# Altium schematic sheet Analog_IN_block.SchDoc
size 420 x 297 mm; DocumentNumber: ЛАЭ3.20.10.02.05.200 Э3; SheetNumber: 7
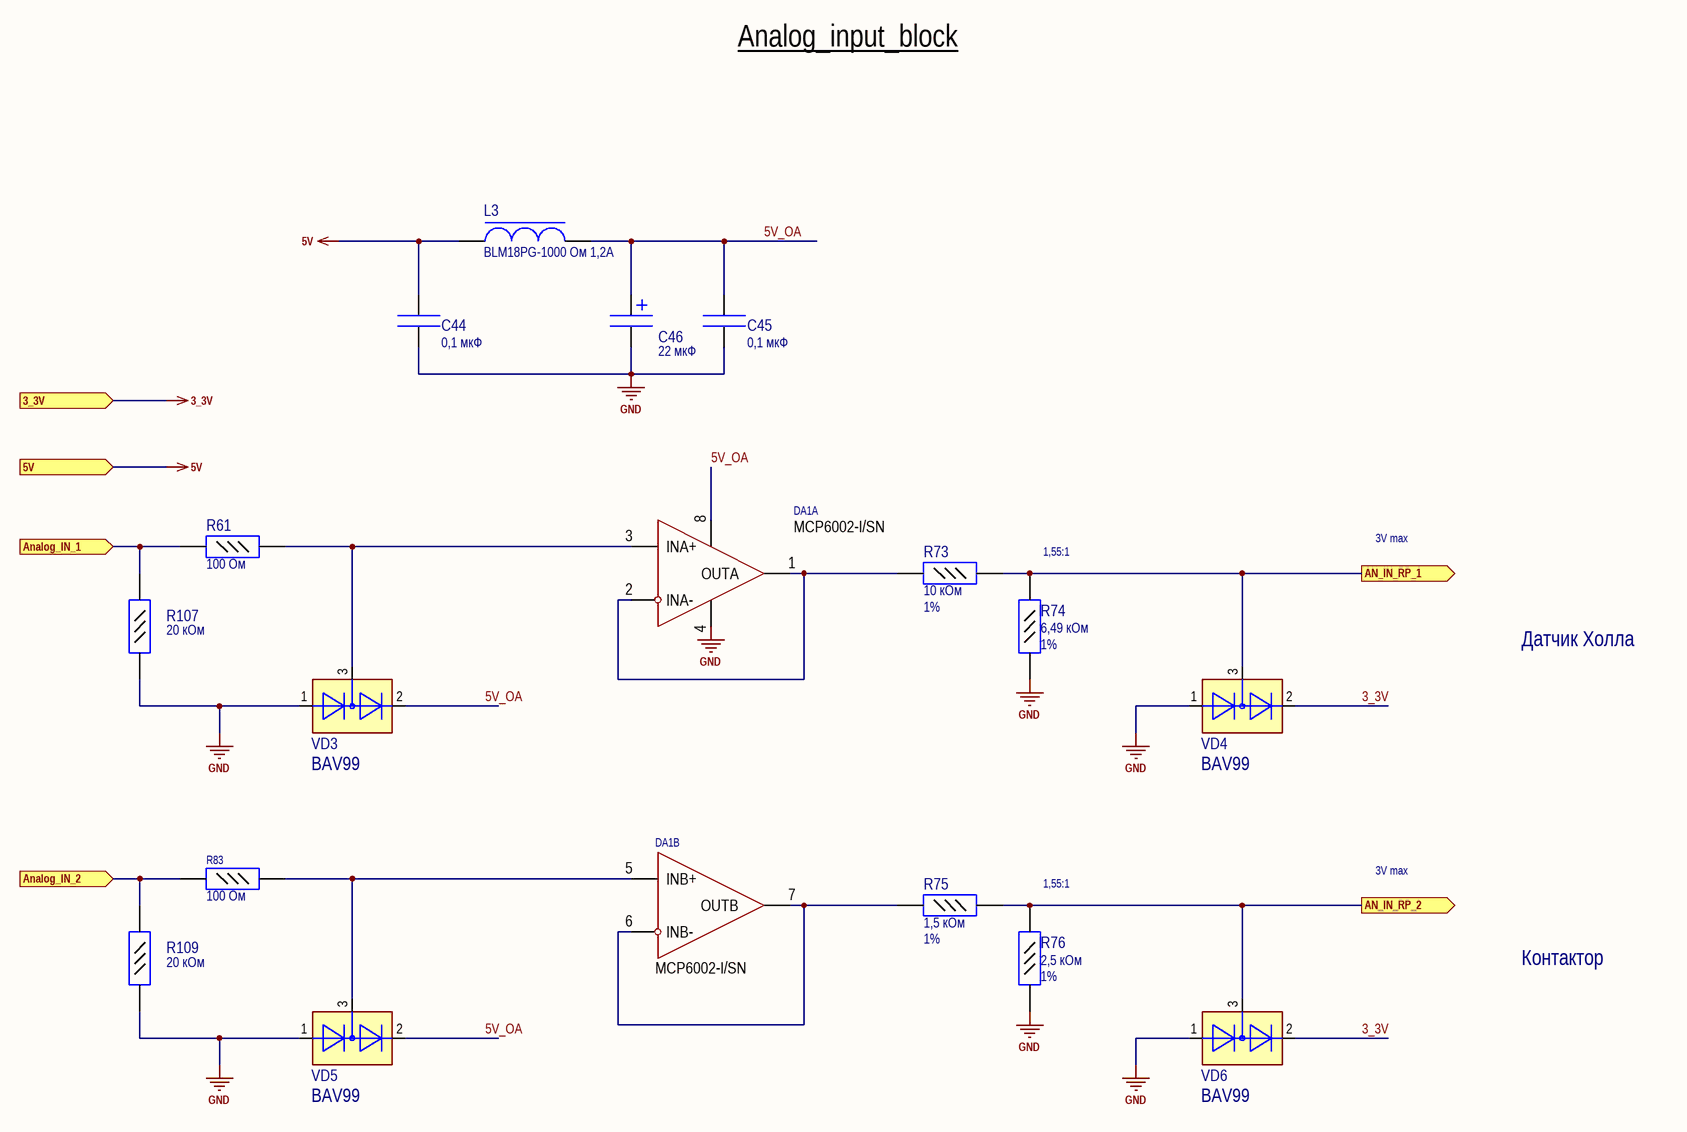
[diagram p0: Analog_IN_block.SchDoc]

## Parts
C44  value 0,1 мкФ  [CC0603]  (hidden comment: CC0603-X7R-0,1 мкФ-20%-50В)
C45  value 0,1 мкФ  [CC0603]  (hidden comment: CC0603-X7R-0,1 мкФ-20%-50В)
C46  value 22 мкФ  [CT-D]  (hidden comment: CT-35V-22мкФ-±20%-D)
DA1  MCP6002-I/SN  [8-SOIC]  (parts A,B of 2)
L3  BLM18PG-1000 Ом 1,2A  [CL0603]
R61  value 100 Ом  [CR0603]  (hidden comment: CR0603-100 Ом-±5%)
R73  value 10 кОм  TOLERANCE: 1%  [CR0603]  (hidden comment: CR0603-10 кОм-±1%)
R74  value 6,49 кОм  TOLERANCE: 1%  [CR0603]  (hidden comment: CR0603-6,49 кОм-±1%)
R75  value 1,5 кОм  TOLERANCE: 1%  [CR0603]  (hidden comment: CR0603-1,5 кОм-±1%)
R76  value 2,5 кОм  TOLERANCE: 1%  [CR0603]  (hidden comment: CR0603-2,5 кОм-±1%)
R83  value 100 Ом  [CR0603]  (hidden comment: CR0603-100 Ом-±5%)
R107  value 20 кОм  [CR0603]  (hidden comment: CR0603-20 кОм-±5%)
R109  value 20 кОм  [CR0603]  (hidden comment: CR0603-20 кОм-±5%)
VD3  BAV99  [SOT-23]
VD4  BAV99  [SOT-23]
VD5  BAV99  [SOT-23]
VD6  BAV99  [SOT-23]

## Ports
3_3V (in), 5V (in), AN_IN_RP_1 (out), AN_IN_RP_2 (out), Analog_IN_1 (in), Analog_IN_2 (in)

## Nets
3_3V: VD4.2 VD6.2 ; port 3_3V
5V: C44.1(+) L3.1 ; port 5V
GND: C44.2(-) C45.2(-) C46.2(-) DA1.4(V-) R74.1(+) R76.1(+) R107.1(+) R109.1(+) VD3.1 VD4.1 VD5.1 VD6.1
5V_OA: C45.1(+) C46.1(+) DA1.8(V+) L3.2 VD3.2 VD5.2
AN_IN_RP_1: R73.2(-) R74.2(-) VD4.3 ; port AN_IN_RP_1
AN_IN_RP_2: R75.2(-) R76.2(-) VD6.3 ; port AN_IN_RP_2
Analog_IN_1: R61.1(+) R107.2(-) ; port Analog_IN_1
Analog_IN_2: R83.1(+) R109.2(-) ; port Analog_IN_2
NetDA1_1: DA1.1(OUTA) DA1.2(INA-) R73.1(+)
NetDA1_3: DA1.3(INA+) R61.2(-) VD3.3
NetDA1_5: DA1.5(INB+) R83.2(-) VD5.3
NetDA1_6: DA1.6(INB-) DA1.7(OUTB) R75.1(+)

## Notes on the sheet
- Analog_input_block
- (near R74) 1,55:1
- 3V max
- Датчик Холла
- (near R76) 1,55:1
- Контактор
- Подп. и дата
- Инв. № дубл.
- Взам. инв. №
- Инв. № подл.
- Изм.
- Лист
- № докум.
- Подп.
- Дата
- 2.106-A3
- Копировал
- Формат А3

## Library data of the parts
C44 C45 = CC0603-X7R-#-20%-50В: Чип конденсатор керамический; Компэл: CC0603KRX7R9BB104; Supplier 1: Newark; Supplier Part Number 1: 65R8251
C46 = CT-35V-#-±20%-D: Чип конденсатор  танталовый
DA1 = MCP6002-I/SN: Manufacturer: Microchip; ValueManufacturerPartNumber: IC op amplifier, Rail-to-Rail, 1 MHz, 1.8...6.0V, -40...+85°C, SO-8; Supply: 1.8...6.0V; OutputType: Rail-to-Rail; GainBandwidth: 1 MHz; Package: SO-8; ComponentType: IC op amplifier; Temperature: -40...+85°C; Supplier 1: RSComponents; Supplier Part Number 1: 6283598; PartNumber: MCP6002-I/SN
L3 = BLM18: Чип индуктивность подавления EMP; VALUE: 1000 Ом; Imax: 1,2A; Supplier 1: Mouser; Supplier Part Number 1: 81-BLM18PG331SN1D
R61 R83 R107 R109 = CR0603-#-±5%: Чип резистор
R73-R76 = CR0603-#-±1%: Чип резистор; Supplier 1: Farnell; Supplier Part Number 1: 2008332
VD3-VD6 = BAV99: Диоды; Supplier 1: Digi-Key; Supplier Part Number 1: BAV99-FDICT-ND